# EAGLE design working (EAGLE 9.5.1)
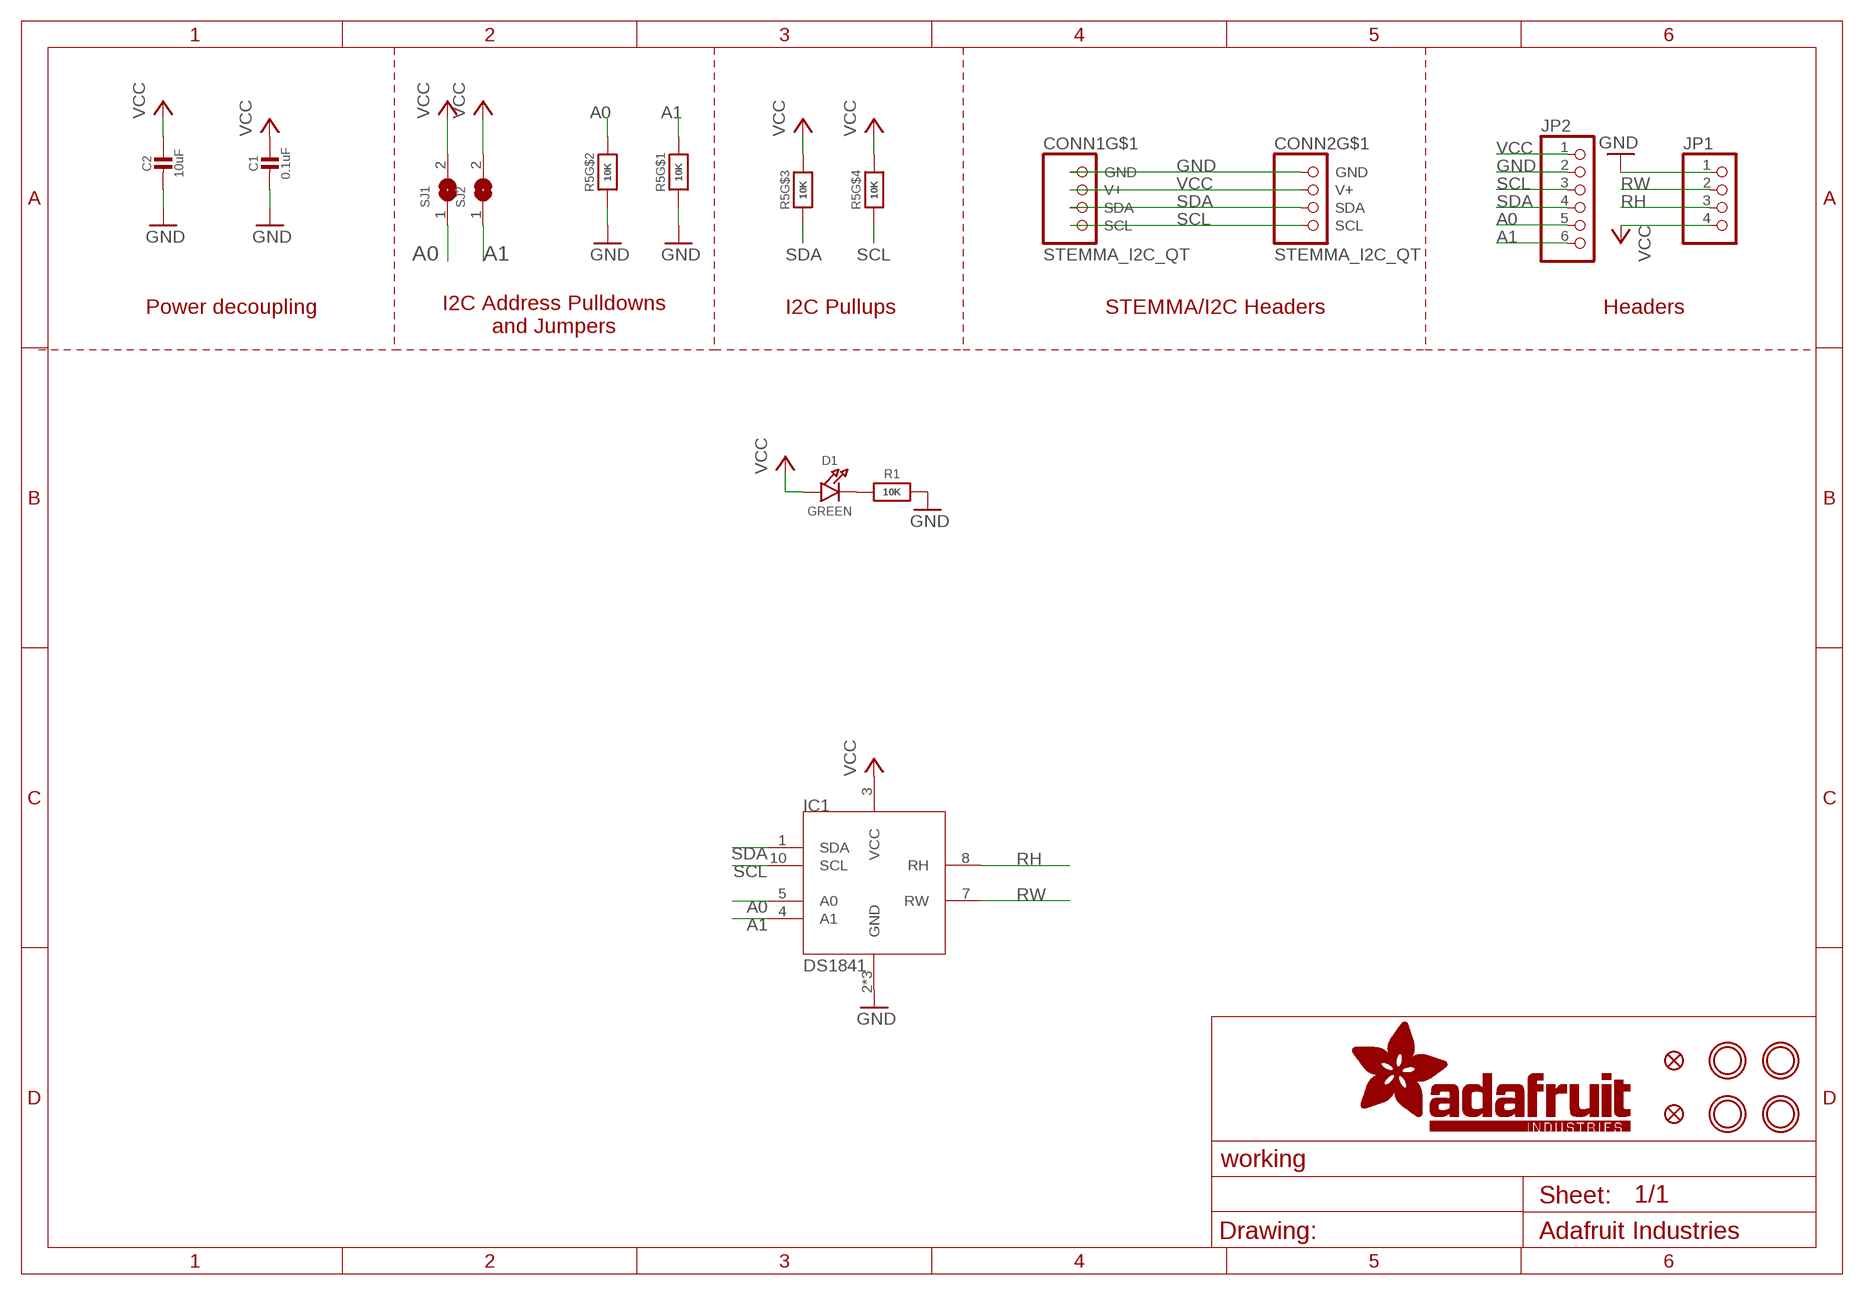
[diagram p0: schematic, sheet 1]

## Parts
C1  0.1uF  CAP_CERAMIC0603_NO  [0603-NO]
C2  10uF  CAP_CERAMIC0805-NOOUTLINE  [0805-NO]
CONN1  STEMMA_I2C_QT  [JST_SH4]
CONN2  STEMMA_I2C_QT  [JST_SH4]
D1  GREEN  LED0603_NOOUTLINE  [CHIPLED_0603_NOOUTLINE]
FID1  FIDUCIAL_1MM  [FIDUCIAL_1MM]
FID2  FIDUCIAL_1MM  [FIDUCIAL_1MM]
IC1  DS1841  [DFN10_3X3MM]
JP1  HEADER-1X4ROUND  [1X04_ROUND]
JP2  HEADER-1X6ROUND  [1X06_ROUND]
R1  10K  RESISTOR_0603_NOOUT  [0603-NO]
R5  10K  RESISTOR_4PACK  [RESPACK_4X0603]
SJ1  SOLDERJUMPER  [SOLDERJUMPER_ARROW_NOPASTE]
SJ2  SOLDERJUMPER  [SOLDERJUMPER_ARROW_NOPASTE]
U$2  MOUNTINGHOLE2.5  [MOUNTINGHOLE_2.5_PLATED]
U$3  MOUNTINGHOLE2.5  [MOUNTINGHOLE_2.5_PLATED]
U$6  MOUNTINGHOLE2.5  [MOUNTINGHOLE_2.5_PLATED]
U$7  MOUNTINGHOLE2.5  [MOUNTINGHOLE_2.5_PLATED]

## Nets
A0: IC1.5(A0) JP2.5 R5.7 SJ1.1
A1: IC1.4(A1) JP2.6 R5.8 SJ2.1
GND: C1.2 C2.2 CONN1.1(GND) CONN2.1(GND) IC1.2(GND) IC1.6(GND) IC1.GND JP1.1 JP2.2 R1.2 R5.1 R5.2
N$2: D1.C R1.1
RH: IC1.8(RH) JP1.3
RW: IC1.7(RW) JP1.2
SCL: CONN1.4(SCL) CONN2.4(SCL) IC1.10(SCL) JP2.3 R5.4
SDA: CONN1.3(SDA) CONN2.3(SDA) IC1.1(SDA) JP2.4 R5.3
VCC: C1.1 C2.1 CONN1.2(V+) CONN2.2(V+) D1.A IC1.3(VCC) JP1.4 JP2.1 R5.5 R5.6 SJ1.2 SJ2.2
Unconnected: CONN1.MT1(MT) CONN1.MT2(MT) CONN2.MT1(MT) CONN2.MT2(MT)

## Notes on the sheet
- Power decoupling
- I2C Address Pulldowns
  and Jumpers
- I2C Pullups | STEMMA/I2C Headers | Headers

## Library data of the parts
C1 C2 = microbuilder:CAP_CERAMIC: Ceramic Capacitors For new designs, use the packages preceded by an '_' character since they are more reliable: The following footprints should be used on most boards: _0402 - Standard footprint for regular board layouts _0603 - Standard footprint for regular board layouts _0805 - Standard footprint for regular board layouts _1206 - Standard footprint for regular board layouts For extremely tight-pitch boards where space is at a premium, the following 'micro-pitch' footprints can be used (smaller pads, no silkscreen outline, etc.): _0402MP - Micro-pitch footprint for very dense/compact boards _0603MP - Micro-pitch footprint for very dense/compact boards _0805MP - Micro-pitch footprint for very dense/compact boards _1206MP - Micro-pitch footprint for very dense/compact boards
CONN1 CONN2 = microbuilder:STEMMA_I2C
D1 = microbuilder:LED: LED 0603 - 0603 Surface Mount Package 2mA: Green LED - Low Power (3.9mcd, 2ma, 1.7Vf) - Digikey: 475-2709-2-ND Orange LED - Low Power (9.8mcd, 2ma, 1.8Vf) - Digikey: 475-1194-2-ND Red LED - Low Power (5mcd, 2ma, 1.8Vf) - Digikey: 475-1195-2-ND Yellow LED - Low Power (7mcd, 2ma, 1.8Vf) - Digikey: 475-1196-2-ND 5mA: Blue LED - Low Power (17mcd, 5ma, 2.9Vf) - Digikey: LNJ937W8CRACT-ND 0805 - 0805 Surface Mount Package 2mA: Red LED (8.8mcd, 2mA, 1.8Vf, Clear) - Low Power [Digikey: 475-2510-1-ND] Green LED (5mcd, 2mA, 1.8Vf, Clear) - Low Power [Digikey: 475-2730-1-ND] Yellow LED (11.3mcd, 2mA, 1.8Vf, Clear) - Low Power [Digikey: 475-2555-1-ND] 20mA: Red LED (104mcd, 20mA, Diffused) - LS R976 [Digikey: 475-1278-6-ND] Red LED (12mcd, 20mA, 2.0Vf, Clear) - APT2012EC [Digikey: 754-1128-1-ND] Green LED (15mcd, 20mA, 2.2Vf, Clear) - APT2012GC [Digikey: 754-1131-1-ND] Orange LED (160mcd, 20mA, 2.1Vf, Clear) - APT2012SECK [Digikey: 754-1130-1-ND] 1206 - 1206 Surface Mount Package Green LED (26mcd, 20mA, Diffused) - LG N971 [Digikey: 475-1407-6-ND] Red LED (15mcd, 20mA, Diffused) - LH N974 [Digikey: 475-1416-6-ND] Cree - Cree High-Power Surface Mount LEDs XPEBWT-L1-0000-00D50 - White 111lm 350mA 2.9Vf 6200K 110° XTEAWT-00-0000-00000LEE3 - White 114lm 350mA 2.85Vf 5000K 115° Everlight - Everlight 45-21 Series Surface Mount LEDs 45-21/QK2C-B2832AC2CB2/2T - Warm White 2000mcd 20mA 3.25Vf 3050K 120° 45-21/LK2C-B38452C4CB2/2T - Nuetral White 2000mcd 20mA 3.25Vf 4150K 120° 45-21/LK2C-B50634C6CB2/2T - Cold White 2200mcd 20mA 3.25Vf 5650K 120° PLCC2 Reverse Mount LS T77K-J1L2-1-0-2-R18-Z - Red 11.25mcd 2mA 1.8Vf 630nm 120° LO T77K-L1M2-24-Z - Orange 19.6mcd 2mA 1.8Vf 606nm 120° LY T77K-K2M1-26-Z - Yellow 15.7mcd 2mA 1.8Vf 587nm 120°
FID1 FID2 = microbuilder:FIDUCIAL: Fiducial Alignment Points Various fiducial points for machine vision alignment.; BOM: EXCLUDE
IC1 = microbuilder:DS1841
JP1 = microbuilder:HEADER-1X4: PIN HEADER
JP2 = microbuilder:HEADER-1X6: PIN HEADER
R1 = microbuilder:RESISTOR: Resistors For new designs, use the packages preceded by an '_' character since they are more reliable: The following footprints should be used on most boards: _0402 - Standard footprint for regular board layouts _0603 - Standard footprint for regular board layouts _0805 - Standard footprint for regular board layouts _1206 - Standard footprint for regular board layouts For extremely tight-pitch boards where space is at a premium, the following 'micro-pitch' footprints can be used (smaller pads, no silkscreen outline, etc.): _0402MP - Micro-pitch footprint for very dense/compact boards _0603MP - Micro-pitch footprint for very dense/compact boards _0805MP - Micro-pitch footprint for very dense/compact boards _1206MP - Micro-pitch footprint for very dense/compact boards
R5 = microbuilder:RESISTOR_4PACK: Resistor Packs (4 resistors) 4 x 0603 10K 1/16W - Digikey: YC164J-10KCT-ND
SJ1 SJ2 = microbuilder:SOLDERJUMPER: SMD Solder JUMPER Solder the two pads together to create a connection, or remove the solder to break it. REFLOW - Use this footprint for solder paste and reflow ovens. WAVE - Use this footprint for hand-soldering (larger pads). CLOSED - Has a trace between the two pads to ensure it is closed by default. The trace needs to be cut to disable the jumper, and can be closed again by creating a solder bridge between the two pads.; BOM: EXCLUDE
U$2 U$3 U$6 U$7 = microbuilder:MOUNTINGHOLE: Mounting Hole For #2 screws (0.086"/2.18mm width, 0.094"/2.4mm hole) use 2.5mm; BOM: EXCLUDE

## Board
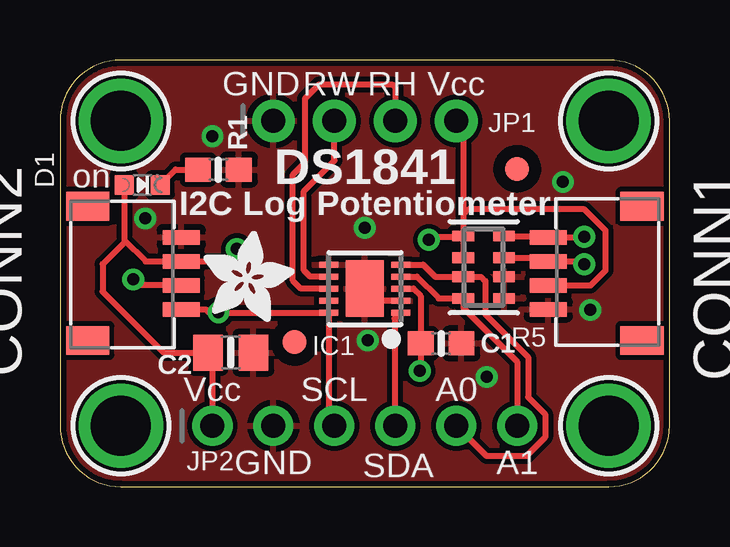
[diagram p1: board, top side]
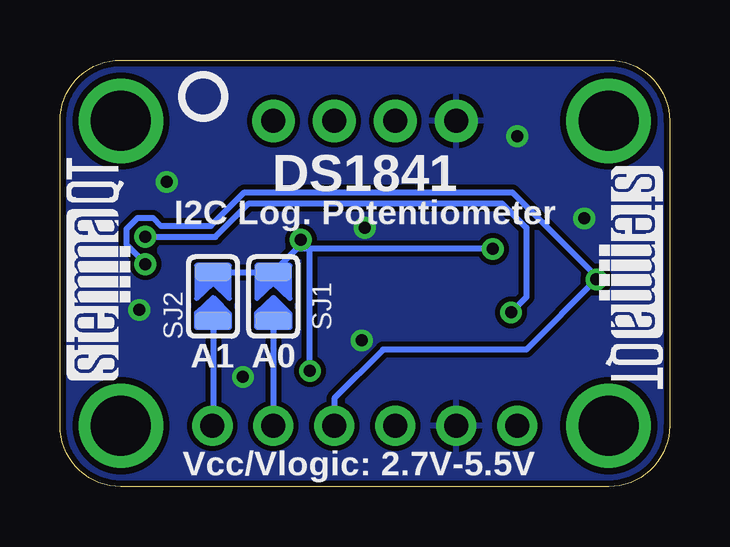
[diagram p2: board, bottom side, seen from below]

Size 25.4 x 17.78 mm. Coordinates in mm from the lower left corner, seen from the top.
Outline: 0,15.24 0,2.54 arc90 2.54,0 22.86,0 arc90 25.4,2.54 25.4,15.24 arc90 22.86,17.78 2.54,17.78 arc90 0,15.24
Copper layers (1*16): Top 0.035mm / dielectric 1.5mm / Bottom 0.035mm
Design rules "adafruit 88": minimum track width 8mil, minimum drill 15.5mil, track to track 8mil, track to pad 8mil, pad to pad 8mil, via to via 8mil, smd to smd 8mil, copper to edge 10mil, drill to drill 8mil, minimum pad ring 10mil, minimum via ring 8mil, stop-mask expansion 2mil, vias tented up to drill 20mil, thermal gap 10mil

### Footprints (pad centres in the part's own frame; a part is rotated, then mirrored left to right if it is on the bottom)
0603-NO = smd 1.075 x 1: 1 -0.85,0; 2 0.85,0
0805-NO = smd 1.24 x 1.5: 1 -0.95,0; 2 0.95,0
JST_SH4 = smd 0.6 x 1.55: 1 -1.5,2.514; 2 -0.5,2.514; 3 0.5,2.514; 4 1.5,2.514 | smd 1.2 x 1.8: MT1 -2.8,-1.386; MT2 2.8,-1.386
CHIPLED_0603_NOOUTLINE = smd 0.8 x 0.8: A 0,-0.75; C 0,0.75
FIDUCIAL_1MM = smd 1 x 1: 1 0,0
DFN10_3X3MM = smd 0.25 x 0.8: 1 -1,-1.5; 2 -0.5,-1.5; 3 0,-1.5; 4 0.5,-1.5; 5 1,-1.5; 6 1,1.5; 7 0.5,1.5; 8 0,1.5; 9 -0.5,1.5; 10 -1,1.5 | smd 2.35 x 1.58: GND 0,0
1X04_ROUND = drill 1 pad 1.778: 1 -3.81,0; 2 -1.27,0; 3 1.27,0; 4 3.81,0
1X06_ROUND = drill 1 pad 1.676: 1 -6.35,0; 2 -3.81,0; 3 -1.27,0; 4 1.27,0; 5 3.81,0; 6 6.35,0
RESPACK_4X0603 = smd 0.45 x 0.9: 1 -1.3,-0.85; 2 -0.4,-0.85; 3 0.4,-0.85; 4 1.3,-0.85; 5 1.3,0.85; 6 0.4,0.85; 7 -0.4,0.85; 8 -1.3,0.85
SOLDERJUMPER_ARROW_NOPASTE = smd 0.762 x 1.524: 1 -1.016,0; 2 1.016,0
MOUNTINGHOLE_2.5_PLATED = drill 2.5 pad 3.2: P$1 0,0

### Placement (x,y rotation side)
C1  15.88,5.97 0 top
C2  7.11,5.59 0 top
CONN1  22.86,8.89 90 top
CONN2  2.54,8.89 270 top
D1  3.43,12.57 270 top
FID1  9.78,6.03 0 top
FID2  19.05,13.25 0 top
IC1  12.7,8.26 90 top
JP1  12.7,15.24 0 top
JP2  12.7,2.54 0 top
R1  6.6,13.21 0 top
R5  17.65,9.14 90 top
SJ1  16.51,7.92 90 bottom
SJ2  19.02,7.92 90 bottom
U$2  2.54,15.24 0 top
U$3  22.86,15.24 0 top
U$6  2.54,2.54 0 top
U$7  22.86,2.54 0 top
U$8  [ADAFRUIT_3.5MM]  5.97,6.86 0 top
U$9  [PCBFEAT-REV-040]  19.43,16.26 0 bottom
U$10  [STEMMAQT]  22.48,4.45 90 bottom
U$11  [STEMMAQT]  2.92,13.34 270 bottom

### Tracks (layer width: path | path; a pad name or v marks a point on that pad's centre or on a via)
A0
  Top 0.254: IC1.5 15.13,9.26 15.64,8.74 R5.7 17.55,8.74 17.72,8.57 17.72,7.18 19.51,5.4 19.51,3.73 20.22,3.02 20.22,2.06 19.43,1.27 17.78,1.27 JP2.5
  Bottom 0.254: SJ1.1 JP2.5
A1
  Top 0.254: IC1.4 14.87,8.76 15.78,7.84 R5.8 16.8,7.45 19.05,5.21 JP2.6
  Bottom 0.254: SJ2.1 19.02,2.56 JP2.6
GND  (via drill 0.5)
  Top 0.254: IC1.2 13.2,7.75 IC1.GND
  other vias: 17.78,4.57 22.1,7.37 12.7,10.79 12.83,6.1 20.95,12.7 6.35,14.61 3.56,11.18
  pour Bottom: 0,17.78 0,0 25.4,0 25.4,17.78
  pour Top: 0,17.78 0,0 25.4,0 25.4,17.78
N$2
  Top 0.254: D1.C 4.81,13.21 R1.1
RH
  Top 0.254: IC1.8 10.03,8.26 9.7,8.59 9.7,13.01 10.21,13.51 10.21,16.18 10.79,16.76 13.84,16.76 13.97,16.64 JP1.3
RW
  Top 0.254: IC1.7 10.42,8.76 10.16,9.02 10.16,12.32 11.43,13.59 JP1.2
SCL  (via drill 0.5)
  Top 0.254: JP2.3 11.2,2.77 IC1.10 11.18,7.24 6.62,7.24 | CONN2.4 6.07,7.39 6.22,7.24 6.62,7.24 | R5.4 20.29,10.44 CONN1.4 21.82,10.39 v21.84,10.41 | v6.6,7.26 6.62,7.24
  Bottom 0.254: v21.84,10.41 18.92,10.41 17.53,11.81 6.99,11.81 5.97,10.79 5.97,7.89 v6.6,7.26
SDA  (via drill 0.5)
  Top 0.254: JP2.4 13.95,2.56 13.95,7 IC1.1 | CONN2.3 3.29,8.39 v3.05,8.64 | R5.3 20.19,9.54 CONN1.3 21.73,9.39 v21.84,9.27
  Bottom 0.254: JP2.4 13.97,3.68 11.94,5.71 5.97,5.71 v3.05,8.64 3.05,8.76 6.55,12.27 17.71,12.27 19.11,10.87 21.19,10.87 21.52,11.2 22.17,11.2 22.63,10.74 22.63,10.09 21.84,9.31 v21.84,9.27
VCC  (via drill 0.5)
  Top 0.254: IC1.3 14.72,8.26 15.03,7.95 C1.1 15.03,4.87 v14.99,4.83 | D1.A 2.68,10.28 | 2.68,10.28 3.56,9.39 CONN2.2 6.85,9.39 v7.37,9.91 | 2.68,10.28 2.68,10.17 1.78,9.27 1.78,8.13 4.32,5.59 C2.1 6.35,5.4 JP2.1 | CONN1.2 22.11,8.39 22.73,9.02 22.73,10.67 21.84,11.56 17.02,11.56 16.8,11.34 | 16.8,11.34 R5.5 16.8,10.41 | 16.8,10.41 R5.6 | v15.37,10.29 15.49,10.41 16.8,10.41 | JP1.4 16.8,14.95 16.8,11.34
  Bottom 0.254: SJ2.2 SJ1.2 15.54,9.91 | v7.37,9.91 14.99,9.91 | 14.99,9.91 15.54,9.91 | 15.54,9.91 15.54,10.11 v15.37,10.29 | v14.99,4.83 14.99,9.91

### Text on the board
tPlace: GND | RW | RH | Vcc | DS1841 | on | I2C Log Potentiometer | Vcc | SCL | A0 | GND | SDA | A1
bPlace: DS1841 | I2C Log. Potentiometer | A0 | A1 | Vcc/Vlogic: 2.7V-5.5V